# Altium schematic sheet SunS_ALS_Interface_Pull_Ups.SchDoc: ALS Interface Pull Ups
size A3; Author: Michał Gumiela
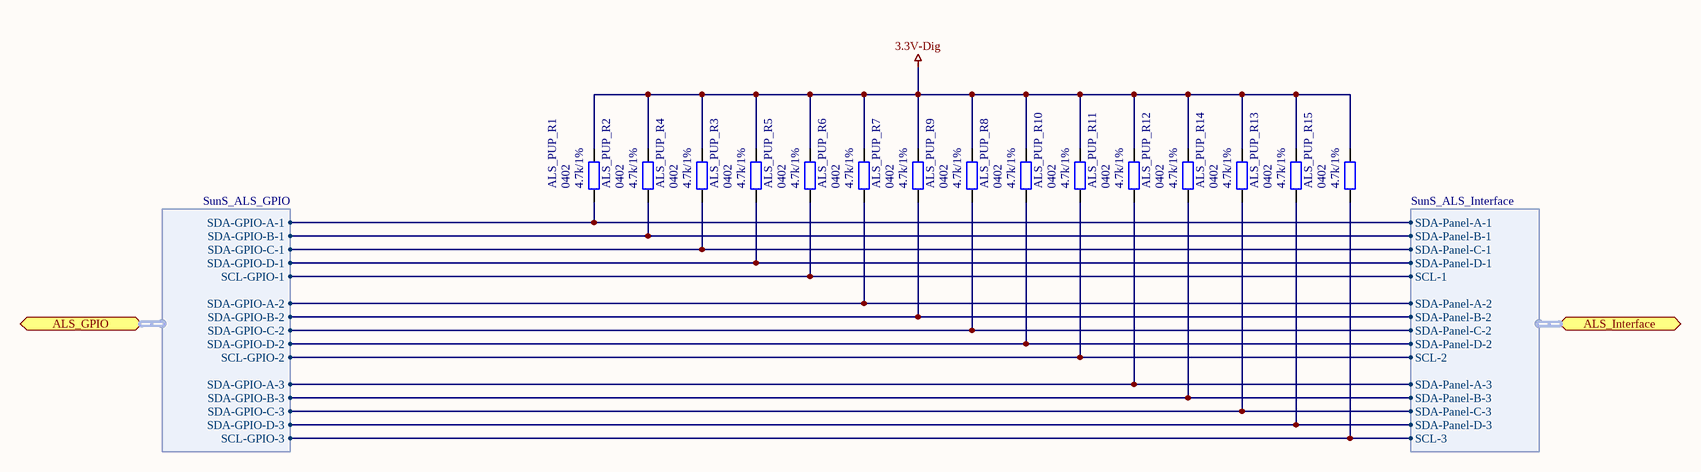
[diagram p0: SunS_ALS_Interface_Pull_Ups.SchDoc]

## Parts
ALS_PUP_R1  Package: 0402  [SMD_Resistor_0402]  (hidden comment: 4.7k/1%)
ALS_PUP_R2  Package: 0402  [SMD_Resistor_0402]  (hidden comment: 4.7k/1%)
ALS_PUP_R3  Package: 0402  [SMD_Resistor_0402]  (hidden comment: 4.7k/1%)
ALS_PUP_R4  Package: 0402  [SMD_Resistor_0402]  (hidden comment: 4.7k/1%)
ALS_PUP_R5  Package: 0402  [SMD_Resistor_0402]  (hidden comment: 4.7k/1%)
ALS_PUP_R6  Package: 0402  [SMD_Resistor_0402]  (hidden comment: 4.7k/1%)
ALS_PUP_R7  Package: 0402  [SMD_Resistor_0402]  (hidden comment: 4.7k/1%)
ALS_PUP_R8  Package: 0402  [SMD_Resistor_0402]  (hidden comment: 4.7k/1%)
ALS_PUP_R9  Package: 0402  [SMD_Resistor_0402]  (hidden comment: 4.7k/1%)
ALS_PUP_R10  Package: 0402  [SMD_Resistor_0402]  (hidden comment: 4.7k/1%)
ALS_PUP_R11  Package: 0402  [SMD_Resistor_0402]  (hidden comment: 4.7k/1%)
ALS_PUP_R12  Package: 0402  [SMD_Resistor_0402]  (hidden comment: 4.7k/1%)
ALS_PUP_R13  Package: 0402  [SMD_Resistor_0402]  (hidden comment: 4.7k/1%)
ALS_PUP_R14  Package: 0402  [SMD_Resistor_0402]  (hidden comment: 4.7k/1%)
ALS_PUP_R15  Package: 0402  [SMD_Resistor_0402]  (hidden comment: 4.7k/1%)

## Ports
ALS_GPIO (harness SunS_ALS_GPIO), ALS_Interface (harness SunS_ALS_Interface)

## Harnesses
SunS_ALS_Interface: SDA-Panel-A-1, SDA-Panel-D-1, SDA-Panel-B-1, SDA-Panel-C-1, SCL-1, SDA-Panel-A-2, SDA-Panel-D-2, SDA-Panel-B-2, SDA-Panel-C-2, SCL-2, SDA-Panel-A-3, SDA-Panel-D-3, SDA-Panel-B-3, SDA-Panel-C-3, SCL-3
SunS_ALS_GPIO: SDA-GPIO-A-1, SDA-GPIO-D-1, SDA-GPIO-B-1, SDA-GPIO-C-1, SCL-GPIO-1, SDA-GPIO-A-2, SDA-GPIO-D-2, SDA-GPIO-B-2, SDA-GPIO-C-2, SCL-GPIO-2, SDA-GPIO-A-3, SDA-GPIO-D-3, SDA-GPIO-B-3, SDA-GPIO-C-3, SCL-GPIO-3

## Nets
3.3V-Dig: ALS_PUP_R1.1 ALS_PUP_R2.1 ALS_PUP_R3.1 ALS_PUP_R4.1 ALS_PUP_R5.1 ALS_PUP_R6.1 ALS_PUP_R7.1 ALS_PUP_R8.1 ALS_PUP_R9.1 ALS_PUP_R10.1 ALS_PUP_R11.1 ALS_PUP_R12.1 ALS_PUP_R13.1 ALS_PUP_R14.1 ALS_PUP_R15.1
NetALS_PUP_R1_2: ALS_PUP_R1.2 ; port ALS_Interface.SDA-Panel-A-1, port ALS_GPIO.SDA-GPIO-A-1
NetALS_PUP_R2_2: ALS_PUP_R2.2 ; port ALS_Interface.SDA-Panel-B-1, port ALS_GPIO.SDA-GPIO-B-1
NetALS_PUP_R3_2: ALS_PUP_R3.2 ; port ALS_Interface.SDA-Panel-D-1, port ALS_GPIO.SDA-GPIO-D-1
NetALS_PUP_R4_2: ALS_PUP_R4.2 ; port ALS_Interface.SDA-Panel-C-1, port ALS_GPIO.SDA-GPIO-C-1
NetALS_PUP_R5_2: ALS_PUP_R5.2 ; port ALS_Interface.SCL-1, port ALS_GPIO.SCL-GPIO-1
NetALS_PUP_R6_2: ALS_PUP_R6.2 ; port ALS_Interface.SDA-Panel-A-2, port ALS_GPIO.SDA-GPIO-A-2
NetALS_PUP_R7_2: ALS_PUP_R7.2 ; port ALS_Interface.SDA-Panel-B-2, port ALS_GPIO.SDA-GPIO-B-2
NetALS_PUP_R8_2: ALS_PUP_R8.2 ; port ALS_Interface.SDA-Panel-D-2, port ALS_GPIO.SDA-GPIO-D-2
NetALS_PUP_R9_2: ALS_PUP_R9.2 ; port ALS_Interface.SDA-Panel-C-2, port ALS_GPIO.SDA-GPIO-C-2
NetALS_PUP_R10_2: ALS_PUP_R10.2 ; port ALS_Interface.SCL-2, port ALS_GPIO.SCL-GPIO-2
NetALS_PUP_R11_2: ALS_PUP_R11.2 ; port ALS_Interface.SDA-Panel-A-3, port ALS_GPIO.SDA-GPIO-A-3
NetALS_PUP_R12_2: ALS_PUP_R12.2 ; port ALS_Interface.SDA-Panel-B-3, port ALS_GPIO.SDA-GPIO-B-3
NetALS_PUP_R13_2: ALS_PUP_R13.2 ; port ALS_Interface.SDA-Panel-D-3, port ALS_GPIO.SDA-GPIO-D-3
NetALS_PUP_R14_2: ALS_PUP_R14.2 ; port ALS_Interface.SDA-Panel-C-3, port ALS_GPIO.SDA-GPIO-C-3
NetALS_PUP_R15_2: ALS_PUP_R15.2 ; port ALS_Interface.SCL-3, port ALS_GPIO.SCL-GPIO-3

## Notes on the sheet
- Title:
- Project:
- Author:
- Model:
- Document Number:
- Checked by:
- Rev:
- Date:
- Approved by:
- Sheet:
- of
- File name:

## Library data of the parts
ALS_PUP_R1-ALS_PUP_R15 = CRCW04024K70FKxxxx: 4.7k/1% Vishay CRCW 0402 Resistor. 63mW, 100ppm, 50V.; ManufacturerPartNumber: CRCW04024K70FKxxxx; Manufacturer: Vishay; Value: 4.7k/1%